# EAGLE design nsl_drone (EAGLE 5.10)

## Sheet 1 of 2
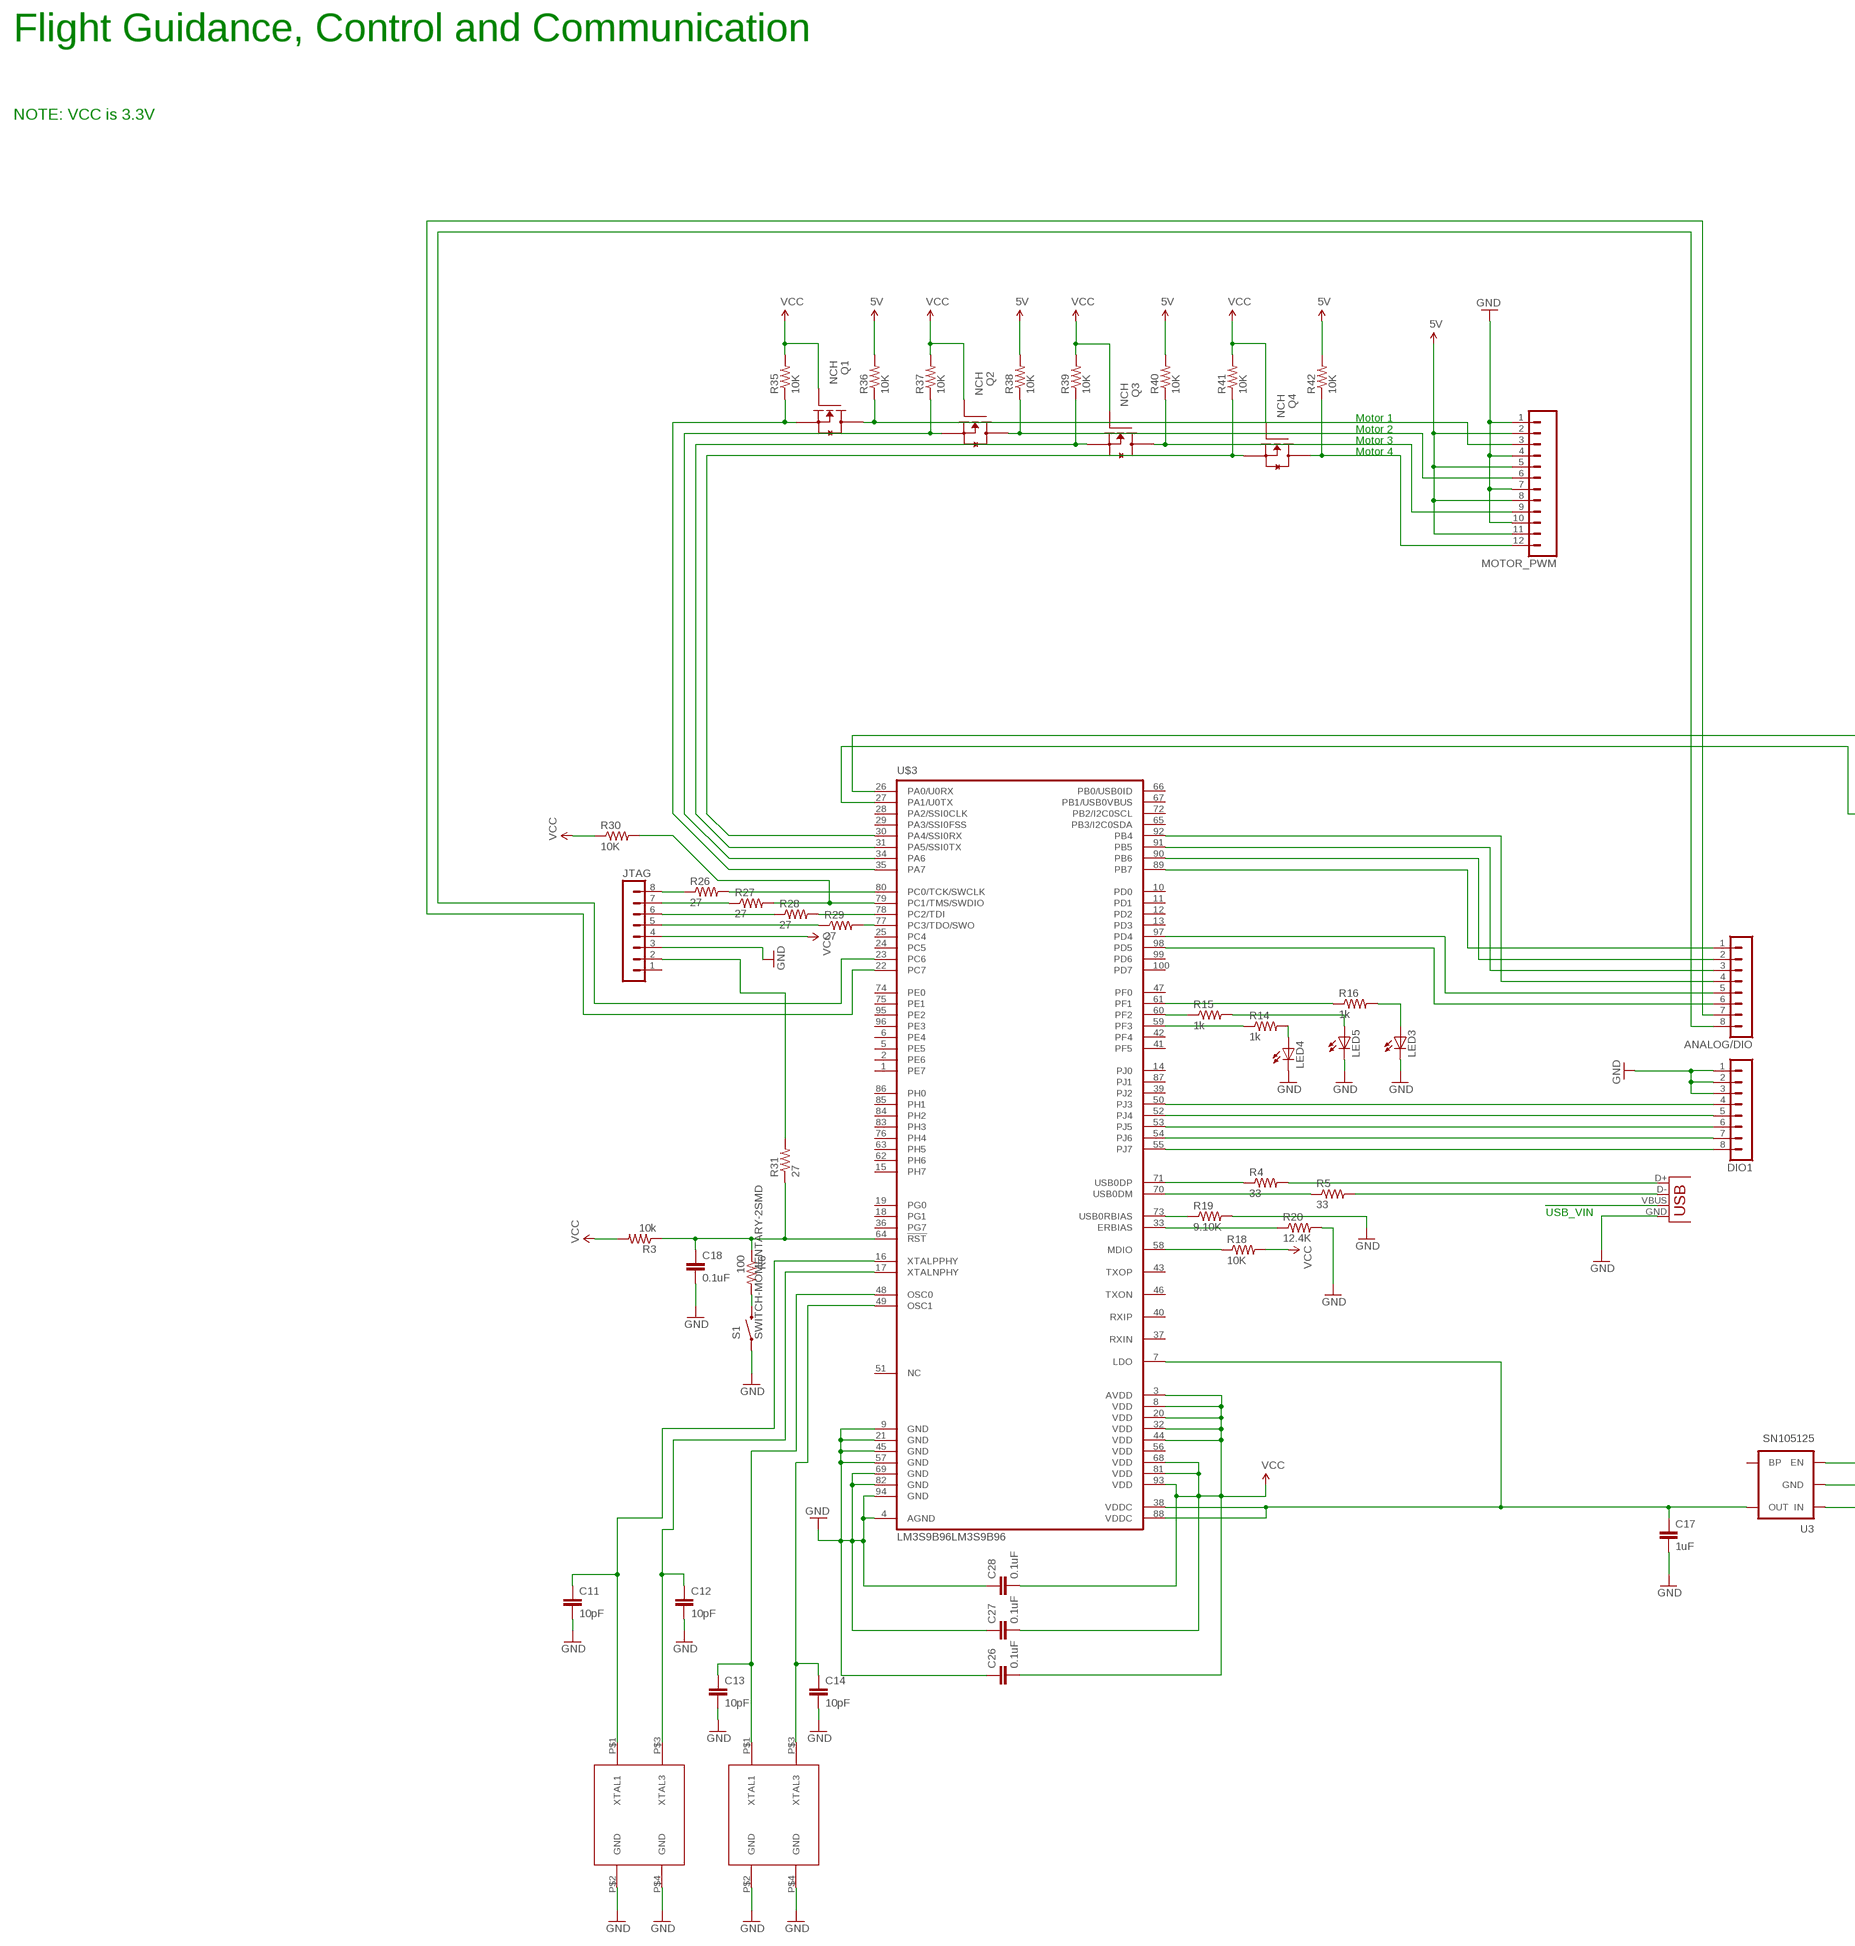
[diagram p0: schematic, sheet 1, part 1 of 2]
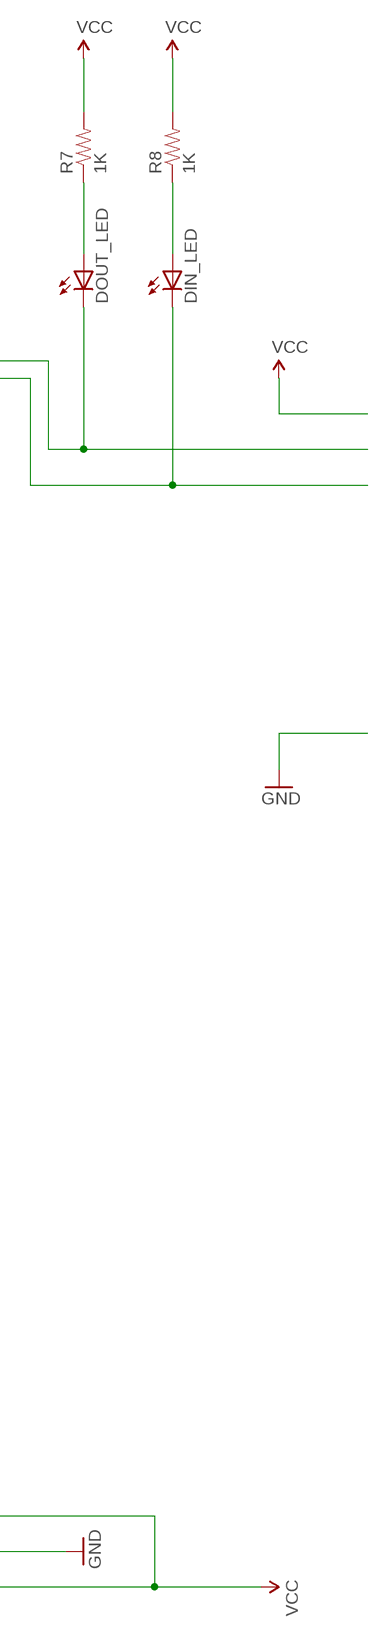
[diagram p1: schematic, sheet 1, part 2 of 2]

### Parts
16MHZ  16MHz  ABM3G  [ABM3G]
25MHZ  25MHz  ABM3G  [ABM3G]
ANALOG/DIO  MA08-1  [MA08-1]
C11  10pF  CAP0402-CAP  [0402-CAP]
C12  10pF  CAP0402-CAP  [0402-CAP]
C13  10pF  CAP0402-CAP  [0402-CAP]
C14  10pF  CAP0402-CAP  [0402-CAP]
C17  1uF  CAP0805  [0805]
C18  0.1uF  CAP0402-CAP  [0402-CAP]
C26  0.1uF  CAP0805  [0805]
C27  0.1uF  CAP0805  [0805]
C28  0.1uF  CAP0805  [0805]
DIN_LED  LED1206  [LED-1206]
DIO1  MA08-1  [MA08-1]
DOUT_LED  LED1206  [LED-1206]
JTAG  MA08-1  [MA08-1]
LED3  LED1206  [LED-1206]
LED4  LED1206  [LED-1206]
LED5  LED1206  [LED-1206]
MOTOR_PWM  M12PTH  [1X12]
Q1  NCH  MOSFET-NCH_SOT-23  [SOT95P280X135-3N]
Q2  NCH  MOSFET-NCH_SOT-23  [SOT95P280X135-3N]
Q3  NCH  MOSFET-NCH_SOT-23  [SOT95P280X135-3N]
Q4  NCH  MOSFET-NCH_SOT-23  [SOT95P280X135-3N]
R3  10k  RESISTOR  [0805]
R4  33  RESISTOR  [0805]
R5  33  RESISTOR  [0805]
R6  100  RESISTOR  [0805]
R7  1K  RESISTOR  [0805]
R8  1K  RESISTOR  [0805]
R14  1k  RESISTOR  [0805]
R15  1k  RESISTOR  [0805]
R16  1k  RESISTOR  [0805]
R18  10K  RESISTOR  [0805]
R19  9.10K  RESISTOR  [0805]
R20  12.4K  RESISTOR  [0805]
R26  27  RESISTOR  [0805]
R27  27  RESISTOR  [0805]
R28  27  RESISTOR  [0805]
R29  27  RESISTOR  [0805]
R30  10K  RESISTOR  [0805]
R31  27  RESISTOR  [0805]
R35  10K  RESISTOR0402-RES  [0402-RES]
R36  10K  RESISTOR0402-RES  [0402-RES]
R37  10K  RESISTOR0402-RES  [0402-RES]
R38  10K  RESISTOR0402-RES  [0402-RES]
R39  10K  RESISTOR0402-RES  [0402-RES]
R40  10K  RESISTOR0402-RES  [0402-RES]
R41  10K  RESISTOR0402-RES  [0402-RES]
R42  10K  RESISTOR0402-RES  [0402-RES]
S1  SWITCH-MOMENTARY-2SMD  [TACTILE_SWITCH_SMD]
U3  SN105125  V_REG_LDOSMD  [SOT23-5]
U$3  LM3S9B96LM3S9B96  [LQFP100]
X2  USBSMD  [USB-MINIB]

### Nets
5V: MOTOR_PWM.2 MOTOR_PWM.5 MOTOR_PWM.8 MOTOR_PWM.11 R36.2 R38.2 R40.2 R42.2 ; also sheet 2
GND: 16MHZ.P$2(GND) 16MHZ.P$4(GND) 25MHZ.P$2(GND) 25MHZ.P$4(GND) C11.2 C12.2 C13.2 C14.2 C17.2 C18.2 C26.1 C27.1 C28.1 DIO1.1 DIO1.2 DIO1.3 JTAG.3 LED3.C LED4.C LED5.C MOTOR_PWM.1 MOTOR_PWM.4 MOTOR_PWM.7 MOTOR_PWM.10 R19.2 R20.2 S1.1 U3.2(GND) U$3.4(AGND) U$3.9(GND) U$3.21(GND) U$3.45(GND) U$3.57(GND) U$3.69(GND) U$3.82(GND) U$3.94(GND) X2.GND ; also sheet 2
MOTOR1: MOTOR_PWM.3 Q1.3(D) R36.1
MOTOR1_LV: Q1.2(S) R35.1 U$3.35(PA7)
MOTOR2: MOTOR_PWM.6 Q2.3(D) R38.1
MOTOR2_LV: Q2.2(S) R37.1 U$3.34(PA6)
MOTOR3: MOTOR_PWM.9 Q3.3(D) R40.1
MOTOR3_LV: Q3.2(S) R39.1 U$3.31(PA5/SSI0TX)
MOTOR4: MOTOR_PWM.12 Q4.3(D) R42.1
MOTOR4_LV: Q4.2(S) R41.1 U$3.30(PA4/SSI0RX)
N$5: LED3.A R16.2
N$6: R4.1 U$3.71(USB0DP)
N$7: R4.2 X2.D+
N$8: C17.1 U3.5(OUT) U$3.7(LDO) U$3.38(VDDC) U$3.88(VDDC)
N$9: R6.2 S1.3
N$10: R5.2 X2.D-
N$12: JTAG.8 R26.1
N$13: R26.2 U$3.80(PC0/TCK/SWCLK)
N$14: R27.2 R30.2 U$3.79(PC1/TMS/SWDIO)
N$15: R5.1 U$3.70(USB0DM)
N$16: DIN_LED.C U$3.27(PA1/U0TX)
N$17: DOUT_LED.C U$3.26(PA0/U0RX)
N$20: JTAG.7 R27.1
N$23: JTAG.6 R28.1
N$24: R28.2 U$3.78(PC2/TDI)
N$25: R29.2 U$3.77(PC3/TDO/SWO)
N$26: JTAG.5 R29.1
N$27: LED5.A R15.2
N$28: LED4.A R14.2
N$29: DIN_LED.A R8.1
N$30: DOUT_LED.A R7.1
N$31: ANALOG/DIO.7 U$3.22(PC7)
N$32: R19.1 U$3.73(USB0RBIAS)
N$33: 25MHZ.P$1(XTAL1) C11.1 U$3.16(XTALPPHY)
N$34: R18.1 U$3.58(MDIO)
N$35: R20.1 U$3.33(ERBIAS)
N$40: 25MHZ.P$3(XTAL3) C12.1 U$3.17(XTALNPHY)
N$43: ANALOG/DIO.8 U$3.23(PC6)
N$44: JTAG.2 R31.2
N$47: 16MHZ.P$1(XTAL1) C13.1 U$3.48(OSC0)
N$48: 16MHZ.P$3(XTAL3) C14.1 U$3.49(OSC1)
N$49: DIO1.8 U$3.55(PJ7)
N$50: DIO1.7 U$3.54(PJ6)
N$51: DIO1.6 U$3.53(PJ5)
N$52: DIO1.5 U$3.52(PJ4)
N$53: DIO1.4 U$3.50(PJ3)
N$56: ANALOG/DIO.6 U$3.98(PD5)
N$57: ANALOG/DIO.5 U$3.97(PD4)
N$58: ANALOG/DIO.1 U$3.89(PB7)
N$59: ANALOG/DIO.2 U$3.90(PB6)
N$61: R14.1 U$3.59(PF3)
N$63: R15.1 U$3.60(PF2)
N$64: ANALOG/DIO.3 U$3.91(PB5)
N$66: R16.1 U$3.61(PF1)
N$69: ANALOG/DIO.4 U$3.92(PB4)
N$72: C18.1 R3.1 R6.1 R31.1 U$3.64(!RST!)
USB_VIN: X2.VBUS ; also sheet 2
VCC: C26.2 C27.2 C28.2 JTAG.4 Q1.1(G) Q2.1(G) Q3.1(G) Q4.1(G) R3.2 R7.2 R8.2 R18.2 R30.1 R35.2 R37.2 R39.2 R41.2 U3.1(IN) U3.3(EN) U$3.3(AVDD) U$3.8(VDD) U$3.20(VDD) U$3.32(VDD) U$3.44(VDD) U$3.68(VDD) U$3.81(VDD) U$3.93(VDD) ; also sheet 2
Unconnected: JTAG.1 U3.4(BP) U$3.1(PE7) U$3.2(PE6) U$3.5(PE5) U$3.6(PE4) U$3.10(PD0) U$3.11(PD1) U$3.12(PD2) U$3.13(PD3) U$3.14(PJ0) U$3.15(PH7) U$3.18(PG1) U$3.19(PG0) U$3.24(PC5) U$3.25(PC4) U$3.28(PA2/SSI0CLK) U$3.29(PA3/SSI0FSS) U$3.36(PG7) U$3.37(RXIN) U$3.39(PJ2) U$3.40(RXIP) U$3.41(PF5) U$3.42(PF4) U$3.43(TXOP) U$3.46(TXON) U$3.47(PF0) U$3.51(NC) U$3.62(PH6) U$3.63(PH5) U$3.65(PB3/I2C0SDA) U$3.66(PB0/USB0ID) U$3.67(PB1/USB0VBUS) U$3.72(PB2/I2C0SCL) U$3.74(PE0) U$3.75(PE1) U$3.76(PH4) U$3.83(PH3) U$3.84(PH2) U$3.85(PH1) U$3.86(PH0) U$3.87(PJ1) U$3.95(PE2) U$3.96(PE3) U$3.99(PD6) U$3.100(PD7)

### Notes on the sheet
- Flight Guidance, Control and Communication
- NOTE: VCC is 3.3V
- Motor 1
- Motor 2
- Motor 3
- Motor 4
- USB_VIN

## Sheet 2 of 2
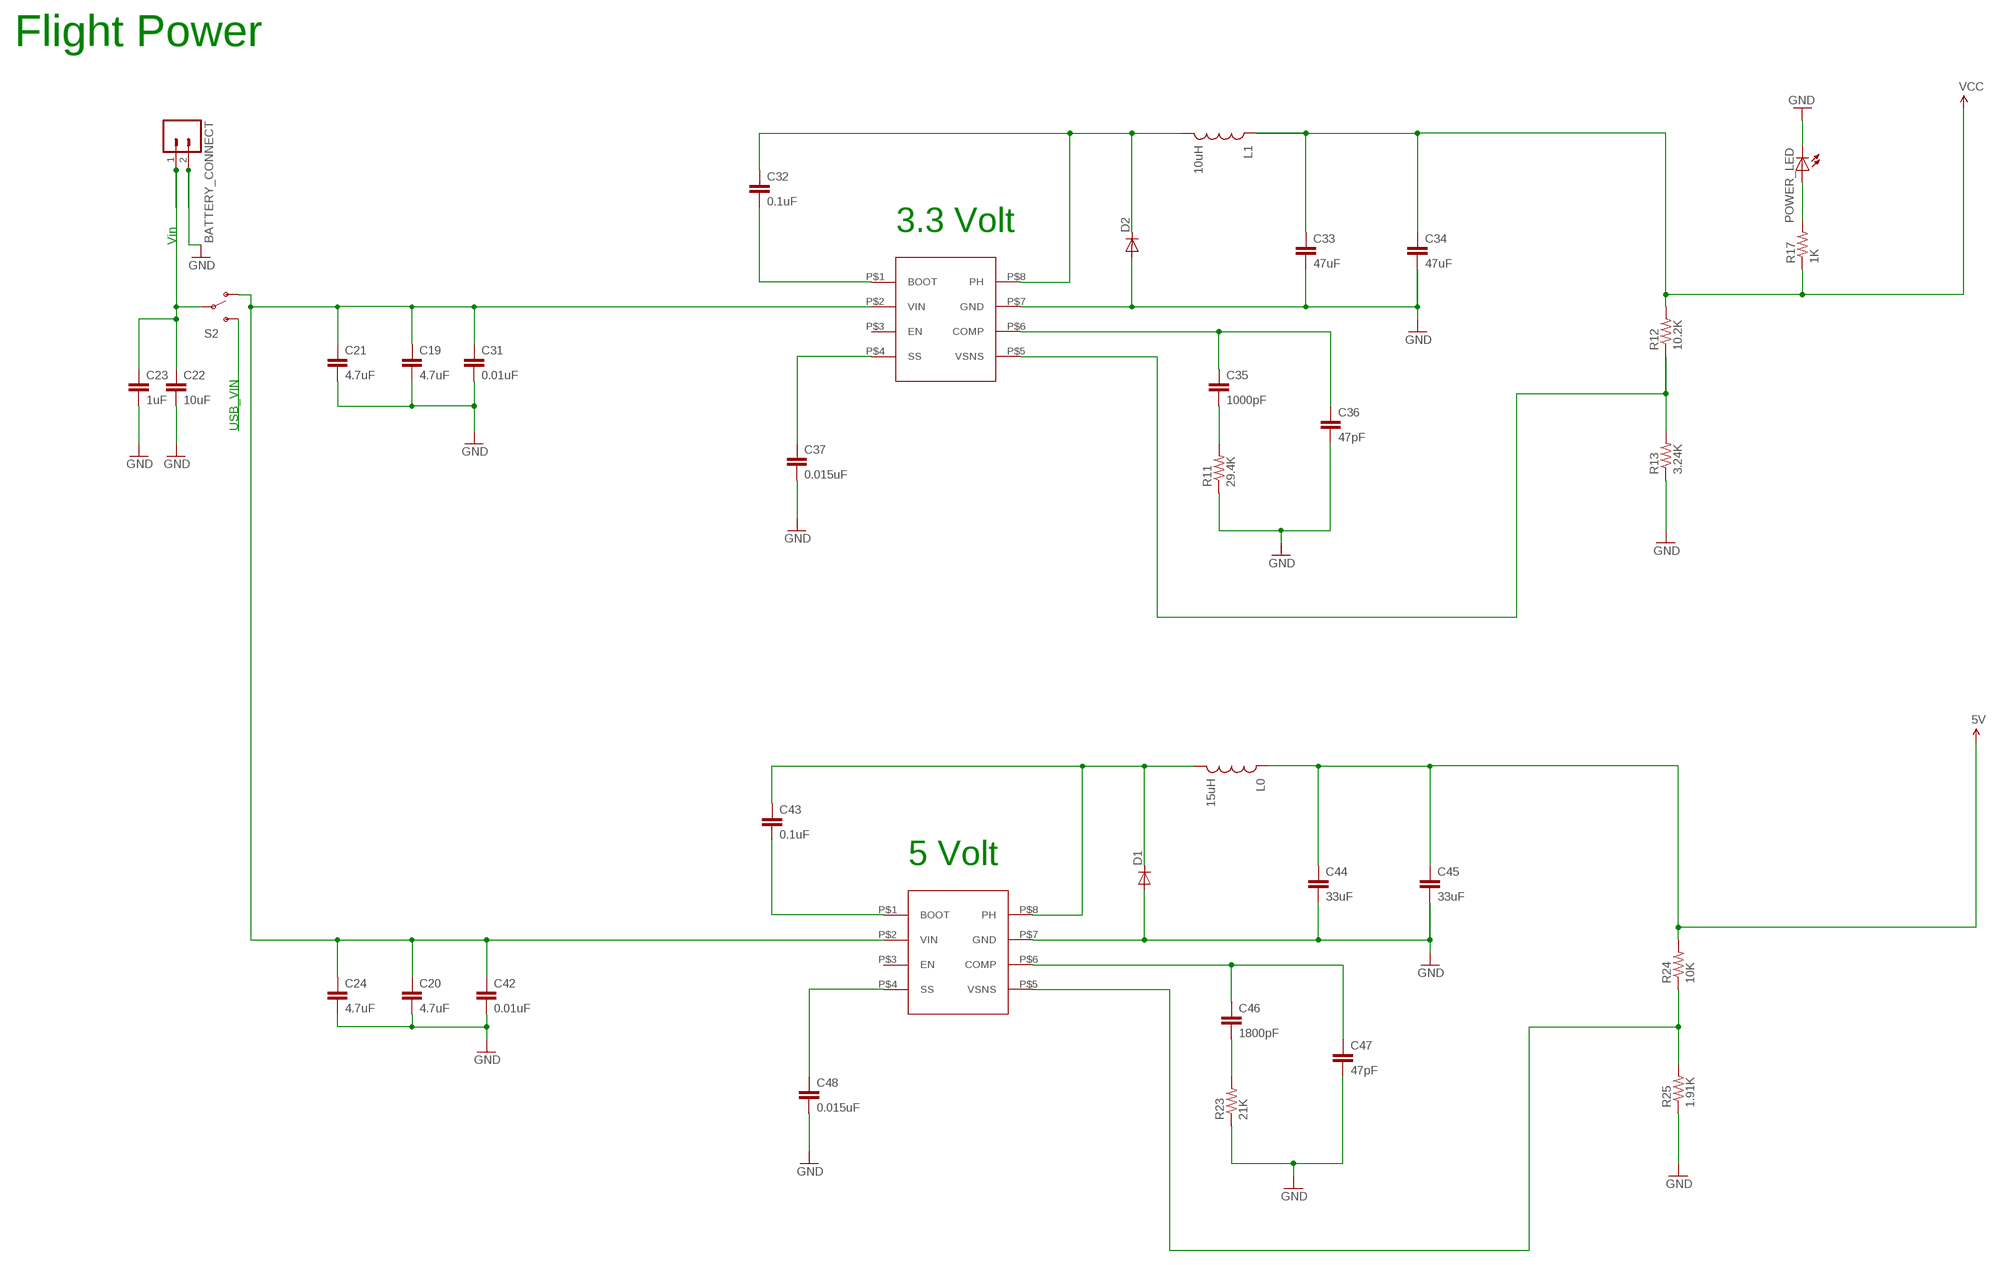
[diagram p2: schematic, sheet 2]

### Parts
BATTERY_CONNECT  M025MM  [SCREWTERMINAL-5MM-2]
C19  4.7uF  CAP0805  [0805]
C20  4.7uF  CAP0805  [0805]
C21  4.7uF  CAP0805  [0805]
C22  10uF  CAP1210  [1210]
C23  1uF  CAP1206  [1206]
C24  4.7uF  CAP0805  [0805]
C31  0.01uF  CAP0805  [0805]
C32  0.1uF  CAP0805  [0805]
C33  47uF  CAP0805  [0805]
C34  47uF  CAP0805  [0805]
C35  1000pF  CAP0805  [0805]
C36  47pF  CAP0805  [0805]
C37  0.015uF  CAP0805  [0805]
C42  0.01uF  CAP0805  [0805]
C43  0.1uF  CAP0805  [0805]
C44  33uF  CAP0805  [0805]
C45  33uF  CAP0805  [0805]
C46  1800pF  CAP0805  [0805]
C47  47pF  CAP0805  [0805]
C48  0.015uF  CAP0805  [0805]
D1  DIODESMA  [SMA-DIODE]
D2  DIODESMA  [SMA-DIODE]
L0  15uH  INDUCTOR1210  [1210]
L1  10uH  INDUCTORCR54  [CR54]
POWER_LED  LED1206  [LED-1206]
R11  29.4K  RESISTOR  [0805]
R12  10.2K  RESISTOR  [0805]
R13  3.24K  RESISTOR  [0805]
R17  1K  RESISTOR  [0805]
R23  21K  RESISTOR  [0805]
R24  10K  RESISTOR  [0805]
R25  1.91K  RESISTOR  [0805]
S2  SWITCH-SPSTPTH  [SWITCH-SPDT]
U$2  TPS54231_3V3  TPS54231  [TPS54231]
U$5  TPS54231_5V  TPS54231  [TPS54231]

### Nets
5V: C44.1 C45.1 L0.1 R24.2 ; also sheet 1
GND: BATTERY_CONNECT.2 C19.2 C20.2 C21.2 C22.2 C23.2 C24.2 C31.2 C33.2 C34.2 C36.2 C37.2 C42.2 C44.2 C45.2 C47.2 C48.2 D1.A D2.A POWER_LED.C R11.1 R13.1 R23.1 R25.1 U$2.P$7(GND) U$5.P$7(GND) ; also sheet 1
N$62: C43.2 U$5.P$1(BOOT)
N$65: C32.2 U$2.P$1(BOOT)
N$67: C32.1 D2.C L1.P$2 U$2.P$8(PH)
N$68: POWER_LED.A R17.2
N$74: C35.1 C36.1 U$2.P$6(COMP)
N$75: C37.1 U$2.P$4(SS)
N$76: C35.2 R11.2
N$77: C43.1 D1.C L0.2 U$5.P$8(PH)
N$78: R12.1 R13.2 U$2.P$5(VSNS)
N$79: C48.1 U$5.P$4(SS)
N$80: C46.1 C47.1 U$5.P$6(COMP)
N$81: C46.2 R23.2
N$82: R24.1 R25.2 U$5.P$5(VSNS)
N$85: BATTERY_CONNECT.1 C22.1 C23.1 S2.2(P)
USB_VIN: S2.3(S) ; also sheet 1
VCC: C33.1 C34.1 L1.P$1 R12.2 R17.1 ; also sheet 1
VIN: C19.1 C20.1 C21.1 C24.1 C31.1 C42.1 S2.1(O) U$2.P$2(VIN) U$5.P$2(VIN)
Unconnected: U$2.P$3(EN) U$5.P$3(EN)

### Notes on the sheet
- Flight Power
- 3.3 Volt
- Vin
- USB_VIN
- 5 Volt

## Power pins joined to a net without a drawn wire
VDD: U$3.56(VDD)

## Library data of the parts
16MHZ 25MHZ = ABM3G:ABM3G
ANALOG/DIO DIO1 JTAG = con-lstb:MA08-1: PIN HEADER
BATTERY_CONNECT = SparkFun:M02: Header 2 Standard 2-pin 0.1" header. Use with straight break away headers (SKU : PRT-00116), right angle break away headers (PRT-00553), swiss pins (PRT-00743), machine pins (PRT-00117), and female headers (PRT-00115). Molex polarized connector foot print use with SKU : PRT-08233 with associated crimp pins and housings.
C11-C14 C17-C24 C26-C28 C31-C37 C42-C48 = SparkFun:CAP: Capacitor Standard 0603 ceramic capacitor, and 0.1" leaded capacitor.
D1 D2 = SparkFun:DIODE: Diode These are standard reverse protection diodes and small signal diodes. SMA package can handle up to about 1A. SOD-323 can handle about 200mA. What the SOD-323 package when ordering, there are some mfgs out there that are 5-pin packages.
DIN_LED DOUT_LED LED3-LED5 POWER_LED = SparkFun:LED: LEDs Standard schematic elements and footprints for 5mm, 3mm, 1206, and 0603 sized LEDs. 5mm - Spark Fun Electronics SKU : COM-00529 (and others)
L0 L1 = SparkFun:INDUCTOR: Inductors Basic Inductor/Choke - 0603 and 1206. Footprints are not proven and vary greatly between part numbers.
MOTOR_PWM = SparkFun:M12: Header 12 Standard 12-pin 0.1" header. Use with straight break away headers (SKU : PRT-00116), right angle break away headers (PRT-00553), swiss pins (PRT-00743), machine pins (PRT-00117), and female headers (PRT-00115).
Q1-Q4 = ipc-7351-transistor:MOSFET-NCH_
R3-R8 R11-R20 R23-R31 R35-R42 = SparkFun:RESISTOR: Resistor Basic schematic elements and footprints for 0603, 1206, and PTH 1/10th watt (small) resistors.
S1 = SparkFun:SWITCH-MOMENTARY-2
S2 = SparkFun:SWITCH-SPST: SPST Switch Simple slide switch. Spark Fun Electronics SKU : COM-00102
U3 = SparkFun:V_REG_LDO: Voltage Regulator LDO Standard 150mA LDO voltage regulator in SOT-23 layout. Micrel part MIC5205. BP (by-pass) pin is used to lower output noise with 470pF cap.
U$2 U$5 = TPS54231:TPS54231
U$3 = luminary-arm:LM3S9B96
X2 = SparkFun:USB: USB Connectors USB-B-PTH is fully proven SKU : PRT-00139 USB-miniB is fully proven SKU : PRT-00587 USB-A-PCB is untested. USB-A-H is throughly reviewed, but untested. Spark Fun Electronics SKU : PRT-00437 USB-B-SMT is throughly reviewed, but untested. Needs silkscreen touching up. USB-A-S has not been used/tested USB-MB-H has not been used/tested

## Board
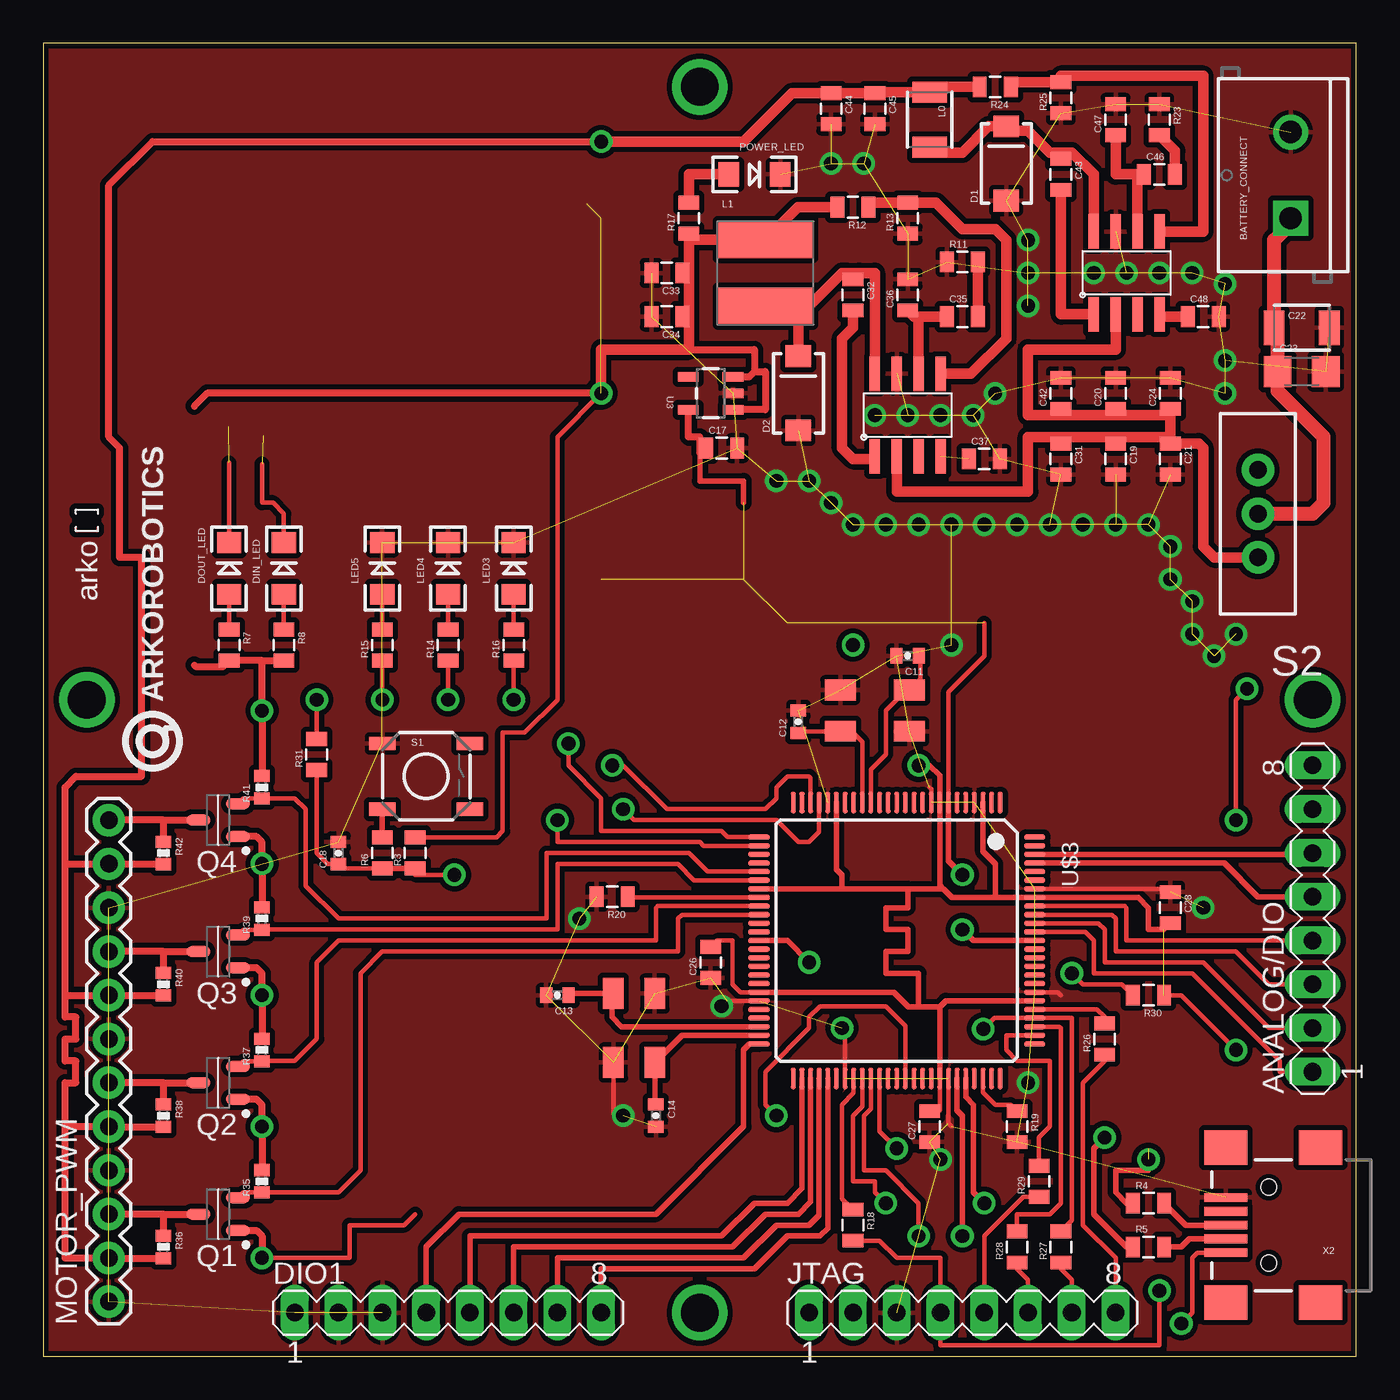
[diagram p3: board, top side]
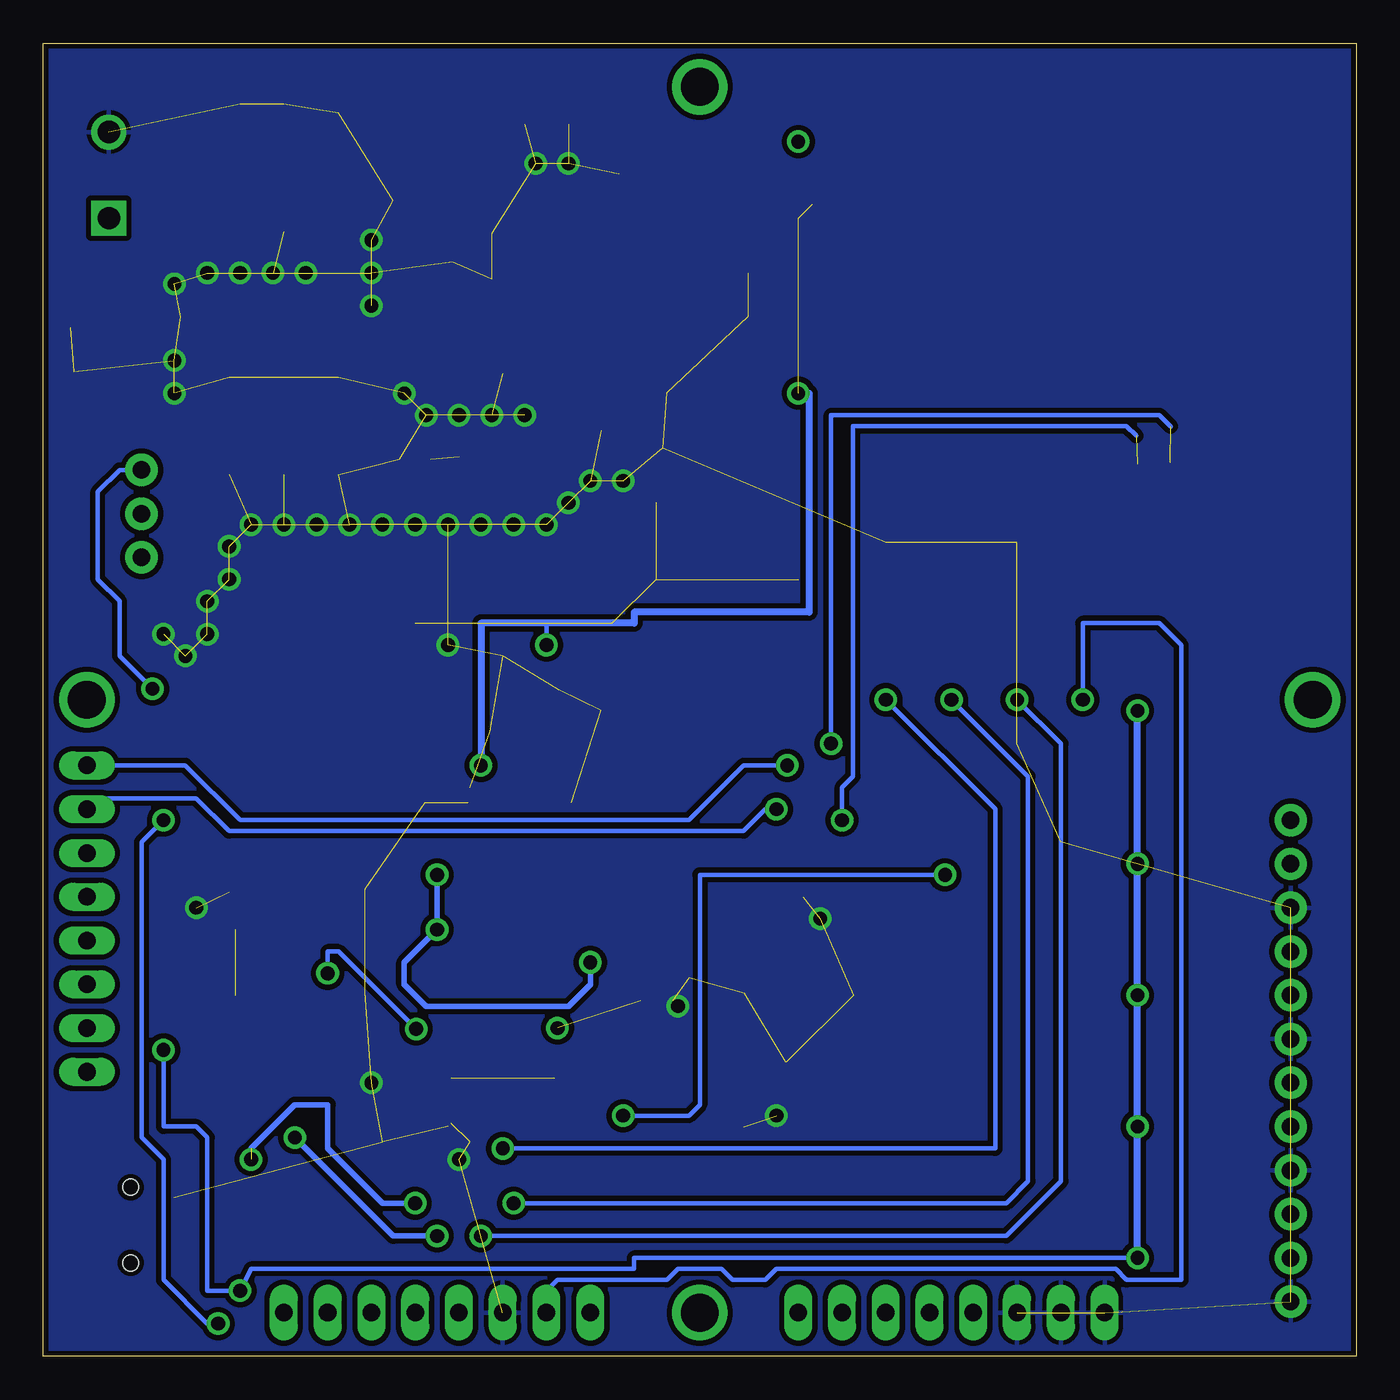
[diagram p4: board, bottom side, seen from below]

Size 76.2 x 76.2 mm. Coordinates in mm from the lower left corner, seen from the top.
Outline: 0,0 76.2,0 76.2,76.2 0,76.2 0,0
Copper layers (1*16): Top 0.0356mm / dielectric 1.5011mm / Bottom 0.0356mm
Design rules "SparkFun-mod": minimum track width 8mil, minimum drill 20mil, track to track 12mil, track to pad 12mil, pad to pad 8mil, via to via 8mil, smd to smd 8mil, copper to edge 12mil, drill to drill 8mil, minimum pad ring 12mil, minimum via ring 10mil, stop-mask expansion 4mil, vias tented up to drill 25mil, thermal gap 10mil
Milling: 4 lines

### Footprints (pad centres in the part's own frame; a part is rotated, then mirrored left to right if it is on the bottom)
ABM3G = smd 1.8 x 1.2: P$1 2,1.2; P$2 -2,1.2; P$3 -2,-1.2; P$4 2,-1.2
MA08-1 = drill 1.016 long: 1 -8.89,0; 2 -6.35,0; 3 -3.81,0; 4 -1.27,0; 5 1.27,0; 6 3.81,0; 7 6.35,0; 8 8.89,0
SCREWTERMINAL-5MM-2 = drill 1.3 pad 2.032 square: 1 0,0 | drill 1.3 pad 2.032 round: 2 5,0
0402-CAP = smd 0.7 x 0.9: 1 -0.65,0; 2 0.65,0
0805 = smd 0.8 x 1.2: 1 -0.9,0; 2 0.9,0
1210 = smd 1.2 x 2: 1 -1.6,0; 2 1.6,0
1206 = smd 1.6 x 1.8: 1 -1.4,0; 2 1.4,0
SMA-DIODE = smd 1.27 x 1.47: A -2.15,0; C 2.15,0
LED-1206 = smd 1.2 x 1.4: A -1.5,0; C 1.5,0
CR54 = smd 5.5 x 2.15: P$1 0,1.92; P$2 0,-1.92
1X12 = drill 1.016 pad 1.88 round: 1 0,0; 2 2.54,0; 3 5.08,0; 4 7.62,0; 5 10.16,0; 6 12.7,0; 7 15.24,0; 8 17.78,0; 9 20.32,0; 10 22.86,0; 11 25.4,0; 12 27.94,0
SOT95P280X135-3N = smd 1.4 x 0.65: 1 -1.15,0.95; 2 -1.15,-0.95; 3 1.15,0
0402-RES = smd 0.7 x 0.9: 1 -0.65,0; 2 0.65,0
TACTILE_SWITCH_SMD = smd 1.524 x 0.762: 1 -2.54,1.905; 2 2.54,1.905; 3 -2.54,-1.905; 4 2.54,-1.905
SWITCH-SPDT = drill 1.016 pad 1.88 round: 1 0,2.54; 2 0,0; 3 0,-2.54
SOT23-5 = smd 0.55 x 1.2: 1 -0.95,-1.3; 2 0,-1.3; 3 0.95,-1.3; 4 0.95,1.3; 5 -0.95,1.3
TPS54231 = smd 0.6 x 2: P$1 -1.905,-2.4; P$2 -0.635,-2.4; P$3 0.635,-2.4; P$4 1.905,-2.4; P$5 1.905,2.4; P$6 0.635,2.4; P$7 -0.635,2.4; P$8 -1.905,2.4
LQFP100 = smd 0.3 x 1.25: 1 -6,-8; 2 -5.5,-8; 3 -5,-8; 4 -4.5,-8; 5 -4,-8; 6 -3.5,-8; 7 -3,-8; 8 -2.5,-8; 9 -2,-8; 10 -1.5,-8; 11 -1,-8; 12 -0.5,-8; 13 0,-8; 14 0.5,-8; 15 1,-8; 16 1.5,-8; 17 2,-8; 18 2.5,-8; 19 3,-8; 20 3.5,-8; 21 4,-8; 22 4.5,-8; 23 5,-8; 24 5.5,-8; 25 6,-8; 51 6,8; 52 5.5,8; 53 5,8; 54 4.5,8; 55 4,8; 56 3.5,8; 57 3,8; 58 2.5,8; 59 2,8; 60 1.5,8; 61 1,8; 62 0.5,8; 63 0,8; 64 -0.5,8; 65 -1,8; 66 -1.5,8; 67 -2,8; 68 -2.5,8; 69 -3,8; 70 -3.5,8; 71 -4,8; 72 -4.5,8; 73 -5,8; 74 -5.5,8; 75 -6,8 | smd 1.25 x 0.3: 26 8,-6; 27 8,-5.5; 28 8,-5; 29 8,-4.5; 30 8,-4; 31 8,-3.5; 32 8,-3; 33 8,-2.5; 34 8,-2; 35 8,-1.5; 36 8,-1; 37 8,-0.5; 38 8,0; 39 8,0.5; 40 8,1; 41 8,1.5; 42 8,2; 43 8,2.5; 44 8,3; 45 8,3.5; 46 8,4; 47 8,4.5; 48 8,5; 49 8,5.5; 50 8,6; 76 -8,6; 77 -8,5.5; 78 -8,5; 79 -8,4.5; 80 -8,4; 81 -8,3.5; 82 -8,3; 83 -8,2.5; 84 -8,2; 85 -8,1.5; 86 -8,1; 87 -8,0.5; 88 -8,0; 89 -8,-0.5; 90 -8,-1; 91 -8,-1.5; 92 -8,-2; 93 -8,-2.5; 94 -8,-3; 95 -8,-3.5; 96 -8,-4; 97 -8,-4.5; 98 -8,-5; 99 -8,-5.5; 100 -8,-6
USB-MINIB = smd 2.5 x 0.5: D+ 2.5,0; D- 2.5,0.8; GND 2.5,-1.6; ID 2.5,-0.8; VBUS 2.5,1.6 | smd 2.5 x 2: GND@1 -3,-4.5; GND@2 -3,4.5; GND@3 2.5,4.5; GND@4 2.5,-4.5 | hole 0.9: 0,2.2; 0,-2.2

### Placement (x,y rotation side)
16MHZ  34.29,19.05 90 top
25MHZ  48.26,37.47 0 top
ANALOG/DIO  73.66,25.4 90 top
BATTERY_CONNECT  72.39,66.04 90 top
C11  50.16,40.64 180 top
C12  43.81,36.83 90 top
C13  29.84,20.95 180 top
C14  35.56,13.97 270 top
C17  39.37,52.7 0 top
C18  17.14,29.21 90 top
C19  62.23,52.07 270 top
C20  62.23,55.88 90 top
C21  65.41,52.07 270 top
C22  73.03,59.69 0 top
C23  73.03,57.15 0 top
C24  65.41,55.88 90 top
C26  38.73,22.86 90 top
C27  51.44,13.34 90 top
C28  65.41,26.04 270 top
C31  59.05,52.07 270 top
C32  46.99,61.59 270 top
C33  36.2,62.87 180 top
C34  36.2,60.33 180 top
C35  53.34,60.33 0 top
C36  50.16,61.59 90 top
C37  54.61,52.07 0 top
C42  59.05,55.88 90 top
C43  59.05,68.58 270 top
C44  45.72,72.39 270 top
C45  48.26,72.39 270 top
C46  64.77,68.58 0 top
C47  62.23,71.75 90 top
C48  67.31,60.33 0 top
D1  55.88,69.22 90 top
D2  43.81,55.88 90 top
DIN_LED  13.97,45.72 90 top
DIO1  23.5,2.54 0 top
DOUT_LED  10.79,45.72 90 top
JTAG  53.34,2.54 0 top
L0  51.44,71.75 270 top
L1  41.91,62.87 0 top
LED3  27.3,45.72 90 top
LED4  23.5,45.72 90 top
LED5  19.68,45.72 90 top
MOTOR_PWM  3.81,3.17 90 top
POWER_LED  41.27,68.58 0 top
Q1  10.16,8.26 180 top
Q2  10.16,15.88 180 top
Q3  10.16,23.5 180 top
Q4  10.16,31.11 180 top
R3  21.59,29.21 90 top
R4  64.14,8.89 0 top
R5  64.14,6.35 0 top
R6  19.68,29.21 90 top
R7  10.79,41.27 270 top
R8  13.97,41.27 270 top
R11  53.34,63.5 0 top
R12  46.99,66.67 180 top
R13  50.16,66.04 90 top
R14  23.5,41.27 90 top
R15  19.68,41.27 90 top
R16  27.3,41.27 90 top
R17  37.47,66.04 90 top
R18  46.99,7.62 270 top
R19  56.52,13.34 270 top
R20  33.02,26.67 180 top
R23  64.77,71.75 270 top
R24  55.24,73.66 180 top
R25  59.05,73.03 90 top
R26  61.59,18.41 90 top
R27  59.05,6.35 90 top
R28  56.52,6.35 90 top
R29  57.78,10.16 90 top
R30  64.14,20.95 180 top
R31  15.88,34.92 90 top
R35  12.7,10.16 90 top
R36  6.99,6.35 270 top
R37  12.7,17.78 90 top
R38  6.99,13.97 270 top
R39  12.7,25.4 90 top
R40  6.99,21.59 270 top
R41  12.7,33.02 90 top
R42  6.99,29.21 270 top
S1  22.23,33.66 0 top
S2  70.48,48.9 180 top
U3  38.73,55.88 90.1 top
U$1  [ARKO_LOGO]  3.17,43.81 90 top
U$2  50.16,54.61 0 top
U$3  49.53,24.13 180 top
U$5  62.87,62.87 0 top
U$7  [ARKOROBOTICS]  6.35,34.29 90 top
X2  71.12,7.62 180 top

### Tracks (layer width: path | path; a pad name or v marks a point on that pad's centre or on a via)
5V  (via drill 0.8)
  Top 0.406: v32.38,70.48 6.35,70.48 3.81,67.94 3.81,53.34 4.45,52.7 4.45,46.35 5.71,46.35 5.71,33.66 1.91,33.66 1.27,33.02 1.27,28.57 | 1.27,28.57 MOTOR_PWM.11 6.97,28.57 R42.2 | 1.27,20.95 1.27,28.57 | 1.27,20.95 MOTOR_PWM.8 3.83,20.94 R40.2 | 1.27,20.95 1.27,19.68 1.91,19.68 1.91,18.41 1.27,18.41 1.27,17.14 1.91,17.14 1.91,15.88 1.27,15.88 1.27,13.34 | 1.27,13.34 MOTOR_PWM.5 3.83,13.32 R38.2 | 1.27,13.34 1.27,5.71 MOTOR_PWM.2 3.83,5.7 R36.2
  Top 0.61: R24.2 51.74,73.66 L0.1 48.33,73.36 C45.1 C44.1 43.45,73.29 40.64,70.48 v32.38,70.48
GND  (via drill 0.8)  (102 unrouted)
  Top 0.254: 16MHZ.P$2 33.09,14.04 v33.66,13.97 | U$3.45 39.68,20.63 v39.37,20.32 | U$3.82 58.88,21.13 59.05,20.95 | U$3.9 51.53,32.92 51.44,33.02 | U$3.69 52.53,13.51 52.7,13.34 | U$3.57 46.53,18.88 46.35,19.05 | U$3.94 65.41,27.13 C28.1
  other vias: 48.26,54.61 68.58,62.23 66.67,62.87 53.98,54.61 50.16,54.61 68.58,57.78 62.87,62.87 64.77,62.87 60.96,62.87 57.15,60.96 47.62,69.22 57.15,62.87 55.24,55.88 68.58,55.88 52.07,54.61 45.72,69.22 57.15,64.77 42.55,50.8 44.45,50.8 45.72,49.53 46.99,48.26 48.9,48.26 50.8,48.26 52.7,48.26 54.61,48.26 56.52,48.26 58.42,48.26 60.33,48.26 62.23,48.26 64.14,48.26 65.41,46.99 65.41,45.09 66.67,43.81 66.67,41.91 67.94,40.64 69.22,41.91 67.31,26.04 57.15,15.88 31.11,25.4 52.07,11.43 52.7,41.27
  pour Bottom: 0,76.2 76.2,76.2 76.2,0 0,0
  pour Top: 0,76.2 76.2,76.2 76.2,0 0,0
MOTOR1
  Top 0.406: 6.99,8.26 MOTOR_PWM.3 | 6.99,8.26 Q1.3 | R36.1 6.99,8.26
MOTOR1_LV
  Top 0.254: U$3.35 37.06,25.63 36.83,25.4 36.83,23.5 19.68,23.5 18.41,22.23 18.41,10.79 17.14,9.53 12.71,9.53 R35.1 11.62,9.51 Q1.2
MOTOR2
  Top 0.406: 6.99,15.88 MOTOR_PWM.6 | 6.99,15.88 Q2.3 | R38.1 6.99,15.88
MOTOR2_LV
  Top 0.254: U$3.34 35.66,26.13 35.56,26.04 35.56,24.13 17.14,24.13 15.88,22.86 15.88,18.41 14.61,17.14 12.71,17.14 R37.1 11.62,17.13 Q2.2
MOTOR3
  Top 0.406: 6.99,23.5 MOTOR_PWM.9 | 6.99,23.5 Q3.3 | R40.1 6.99,23.5
MOTOR3_LV
  Top 0.254: U$3.31 37.77,27.63 36.83,28.57 29.84,28.57 29.84,24.77 12.71,24.77 R39.1 11.62,24.75 Q3.2
MOTOR4
  Top 0.406: 6.99,31.11 MOTOR_PWM.12 | 6.99,31.11 Q4.3 | R42.1 6.99,31.11
MOTOR4_LV
  Top 0.254: U$3.30 38.55,28.13 37.47,29.21 29.21,29.21 29.21,25.4 17.14,25.4 15.24,27.3 15.24,31.75 14.61,32.38 12.71,32.38 | R41.1 11.62,32.37 Q4.2 | R41.1 12.71,32.38 | 12.71,32.38 12.7,32.38 R41.1
N$5
  Top 0.254: R16.2 LED3.A
N$6  (via drill 0.8)  (1 unrouted)
  Top 0.305: U$3.71 53.53,15.05 53.98,14.61 53.98,9.53 v54.61,8.89 | R4.1 62.87,8.89 62.23,9.53 62.23,10.79 64.14,10.79 v64.14,11.43
  Bottom 0.305: v54.61,8.89 56.52,8.89 59.69,12.06 59.69,14.61 61.59,14.61 64.14,12.06
N$7
  Top 0.305: X2.D+ 66.31,7.62 R4.2
N$8  (via drill 0.8)  (4 unrouted)
  Top 0.254: U$3.7 52.53,38.56 54.61,40.64 54.61,42.55
  Top 0.305: U$3.7 52.53,28.75 v53.34,27.94 | U$3.88 53.98,24.13 v53.34,24.77 | U$3.38 43.18,24.13 v44.45,22.86 | 38.1,52.7 38.1,50.8 40.64,50.8 40.64,49.53
  Top 0.406: U3.5 37.44,53.37 37.47,53.34 38.1,53.34 38.1,52.7 | 38.1,52.7 38.1,52.44 C17.1 38.1,52.7
  Bottom 0.305: v53.34,27.94 v53.34,24.77 55.24,22.86 55.24,21.59 53.98,20.32 45.72,20.32 44.45,21.59 v44.45,22.86
N$9
  Top 0.305: R6.2 S1.3
N$10
  Top 0.305: X2.D- 66.51,6.82 66.04,6.35 R5.2
N$11  (via drill 0.8)
  other vias: 46.35,19.05
N$12
  Top 0.254: R26.1 61.59,17.14 60.33,15.88 60.33,7.62 62.23,5.71 JTAG.8
N$13
  Top 0.254: U$3.80 61.15,20.13 61.59,19.68 R26.2
N$14  (via drill 0.8)
  Top 0.254: R27.2 59.69,7.88 59.69,19.63 U$3.79 55.19,19.63 v54.55,19 | v59.69,22.23 60.33,21.59 62.6,21.59 R30.2
  Bottom 0.254: 54.61,19.05 v54.55,19 59.05,23.5 59.69,23.5 v59.69,22.23
N$15  (via drill 0.8)
  Top 0.305: U$3.70 53.03,14.28 53.34,13.97 v53.34,6.99 | R5.1 62.87,6.35 60.96,8.26 60.96,12.06 v61.59,12.7
  Bottom 0.305: v53.34,6.99 55.88,6.99 v61.59,12.7
N$16  (via drill 0.8)  (1 unrouted)
  Top 0.254: U$3.27 38.31,29.63 38.1,29.84 29.84,29.84 v29.84,31.11 | DIN_LED.C 13.97,48.9 13.34,49.53 12.7,49.53 12.7,51.78
  Bottom 0.254: 12.78,53.42 13.34,53.98 29.21,53.98 29.21,33.66 29.84,33.02 v29.84,31.11
N$17  (via drill 0.8)  (1 unrouted)
  Top 0.254: U$3.26 39.72,30.13 39.37,30.48 32.38,30.48 32.38,32.38 30.48,34.29 v30.48,35.56 | DOUT_LED.C 10.79,51.85
  Bottom 0.254: 10.78,53.96 11.43,54.61 30.48,54.61 v30.48,35.56
N$20
  Top 0.254: R27.1 59.05,5.08 59.69,4.45 JTAG.7
N$23
  Top 0.254: R28.1 56.52,5.08 57.15,4.45 JTAG.6
N$24
  Top 0.254: U$3.78 58.98,19.13 59.05,19.05 59.05,8.89 58.42,8.26 56.52,8.26 R28.2
N$25
  Top 0.254: U$3.77 55.88,18.63 55.88,17.78 56.52,17.14 58.42,17.14 58.42,13.34 57.78,12.7 R29.2
N$26
  Top 0.254: R29.1 56.88,9.26 54.61,6.99 JTAG.5
N$27
  Top 0.254: R15.2 LED5.A
N$28
  Top 0.254: R14.2 LED4.A
N$29
  Top 0.254: R8.1 DIN_LED.A
N$30
  Top 0.254: R7.1 DOUT_LED.A
N$31  (via drill 0.8)
  Top 0.254: U$3.22 45.03,30.43 44.45,29.84 43.81,29.84 42.55,31.11 34.29,31.11 v33.66,31.75
  Bottom 0.254: v33.66,31.75 34.29,31.75 35.56,30.48 65.41,30.48 67.31,32.38 73.03,32.38 ANALOG/DIO.7
N$32
  Top 0.254: U$3.73 54.53,15.32 55.24,14.61 56.15,14.61 R19.1
N$33
  Top 0.254: U$3.16 48.03,34.06 48.9,34.92 48.9,37.47 50.09,38.66 25MHZ.P$1 50.9,39.3 50.9,40.56 C11.1
N$34
  Top 0.254: U$3.58 47.03,15.28 46.35,14.61 46.35,9.15 R18.1
N$35
  Top 0.254: U$3.33 33.96,26.63 R20.1
N$40
  Top 0.254: U$3.17 47.53,35.66 46.99,36.2 46.33,36.2 25MHZ.P$3 43.9,36.27 C12.1
N$43  (via drill 0.8)
  Top 0.254: U$3.23 44.53,33.58 44.45,33.66 43.18,33.66 42.55,33.02 42.55,32.38 41.91,31.75 36.2,31.75 33.66,34.29 v33.02,34.29
  Bottom 0.254: v33.02,34.29 35.56,34.29 38.73,31.11 64.77,31.11 67.94,34.29 ANALOG/DIO.8
N$44  (via drill 0.8)
  Top 0.254: v15.88,38.1 R31.2
  Bottom 0.254: JTAG.2 46.99,3.81 46.35,4.45 40.01,4.45 39.37,5.08 36.83,5.08 36.2,4.45 34.29,4.45 33.66,5.08 13.97,5.08 13.34,4.45 10.16,4.45 10.16,41.27 11.43,42.55 15.88,42.55 v15.88,38.1
N$45  (via drill 2.2)
  other vias: 38.1,2.54
N$46  (via drill 2.2)
  other vias: 73.66,38.1
N$47
  Top 0.305: U$3.48 33.58,19.13 33.02,19.68 33.02,20.98 16MHZ.P$1 30.59,21.05 C13.1
N$48
  Top 0.305: U$3.49 37.07,18.63 16MHZ.P$3 35.49,14.69 C14.1
N$49
  Top 0.305: U$3.55 45.53,7.43 45.09,6.99 43.18,6.99 41.27,5.08 32.38,5.08 DIO1.8
N$50
  Top 0.305: U$3.54 45.03,8.2 44.45,7.62 42.55,7.62 40.64,5.71 29.84,5.71 DIO1.7
N$51
  Top 0.305: U$3.53 44.53,8.97 43.81,8.26 41.91,8.26 40.01,6.35 27.3,6.35 DIO1.6
N$52
  Top 0.305: U$3.52 44.03,9.74 43.18,8.89 41.27,8.89 39.37,6.99 24.77,6.99 DIO1.5
N$53
  Top 0.305: U$3.50 40.99,18.13 40.64,17.78 40.64,13.34 35.56,8.26 24.13,8.26 22.23,6.35 DIO1.4
N$54  (via drill 2.2)
  other vias: 2.54,38.1
N$55  (via drill 2.2)
  other vias: 38.1,73.66
N$56
  Top 0.305: U$3.98 73.58,29.13 ANALOG/DIO.6
N$57
  Top 0.305: U$3.97 68.53,28.63 70.48,26.67 ANALOG/DIO.5
N$58
  Top 0.254: ANALOG/DIO.1 71.75,16.51 71.75,17.14 66.67,22.23 60.96,22.23 60.96,24.13 60.46,24.63 U$3.89
N$59
  Top 0.254: U$3.90 61.23,25.13 61.59,24.77 61.59,22.86 67.31,22.86 71.12,19.05 ANALOG/DIO.2
N$61  (via drill 0.8)
  Top 0.254: U$3.59 47.53,14.51 46.99,13.97 46.99,10.16 48.26,10.16 48.26,9.53 v48.9,8.89 | v23.5,38.1 R14.1
  Bottom 0.254: v48.9,8.89 20.32,8.89 19.05,10.16 19.05,33.66 v23.5,38.1
N$62
  Top 0.61: U$5.P$1 59.05,60.47 C43.2
N$63  (via drill 0.8)
  Top 0.254: U$3.60 48.03,14.38 47.62,13.97 47.62,10.79 48.9,10.79 50.8,8.89 v50.8,6.99 | v19.68,38.1 R15.1
  Bottom 0.254: v50.8,6.99 20.32,6.99 17.14,10.16 17.14,35.56 v19.68,38.1
N$64
  Top 0.254: U$3.91 62,25.63 62.23,25.4 62.23,23.5 69.22,23.5 71.12,21.59 ANALOG/DIO.3
N$65
  Top 0.61: C32.2 46.99,59.69 46.35,59.05 46.35,52.7 46.99,52.07 48.12,52.07 U$2.P$1
N$66  (via drill 0.8)
  Top 0.254: v27.3,38.1 R16.1 | U$3.61 48.53,13.06 v49.53,12.06
  Bottom 0.254: v27.3,38.1 20.95,31.75 20.95,12.06 v49.53,12.06
N$67
  Top 0.61: U$2.P$8 48.26,62.87 47.36,62.87 | 47.36,62.87 C32.1 46.62,62.87 | L1.P$2 43.83,60.95 | 46.62,62.87 46.35,62.87 44.44,60.95 43.83,60.95 | 46.62,62.87 47.36,62.87 | 43.83,60.95 43.81,60.96 D2.C
N$68
  Top 0.61: R17.2 37.47,68.58 POWER_LED.A
N$69
  Top 0.254: U$3.92 62.77,26.13 62.87,26.04 62.87,24.13 ANALOG/DIO.4
N$72  (via drill 0.8)
  Top 0.254: v42.55,13.97 41.91,14.61 41.91,16.51 44.45,19.05 44.45,19.68 45.09,20.32 48.9,20.32 50.03,19.18 U$3.64 | v23.86,27.94 21.59,27.94 R3.1 | R6.1 17.39,28.31 C18.1 17.13,28.57 16.51,28.57 15.88,29.21 R31.1
  Top 0.305: R6.1 R3.1
  Bottom 0.254: v42.55,13.97 38.73,13.97 38.1,14.61 38.1,27.94 v23.86,27.94
N$74
  Top 0.61: 50.8,60.33 C35.1 | C36.1 50.53,60.33 50.8,60.33 | 50.8,60.33 U$2.P$6
N$75  (1 unrouted)
N$76
  Top 0.61: C35.2 R11.2
N$77
  Top 0.61: U$5.P$8 60.96,68.58 59.69,69.85 59.42,69.85 | 59.42,69.85 C43.1 59.05,69.85 | 59.05,69.85 58.42,69.85 57.15,71.12 56.12,71.12 D1.C 54.85,71.36 53.34,69.85 51.74,69.85 L0.2 | 59.05,69.85 59.42,69.85
N$78
  Top 0.61: R12.1 48.16,66.94 R13.2 51.8,66.94 53.34,65.41 55.24,65.41 55.88,64.77 55.88,59.05 53.84,57.01 U$2.P$5
N$79
  Top 0.61: C48.1 64.77,60.33 U$5.P$4
N$80
  Top 0.61: U$5.P$6 63.5,67.94 63.5,68.21 | 63.5,68.21 C46.1 63.5,68.58 | 63.5,68.58 62.23,68.58 C47.1 | 63.5,68.21 63.5,68.58
N$81
  Top 0.61: C46.2 65.67,69.95 R23.2
N$82
  Top 0.61: U$5.P$5 67.31,65.27 67.31,74.3 59.05,74.3 R25.2 56.15,73.92 R24.1
N$85
  Top 0.813: S2.2 73.66,48.9 74.3,49.53 74.3,53.34 71.62,56.01 C23.1 71.62,59.69 C22.1 71.42,64.77 72.39,65.73 BATTERY_CONNECT.1
USB_VIN  (via drill 0.8)
  Top 0.254: X2.VBUS 66.98,6.02 66.67,5.71 66.67,2.54 v66.04,1.91 | v69.85,38.73 69.22,38.1 v69.22,31.11
  Bottom 0.254: S2.3 71.75,51.44 73.03,50.16 73.03,45.09 71.75,43.81 71.75,40.64 v69.85,38.73 | v66.04,1.91 66.67,1.91 69.22,4.45 69.22,11.43 70.48,12.7 70.48,29.84 v69.22,31.11
VCC  (via drill 0.8)  (3 unrouted)
  Top 0.254: U$3.44 40.47,21.13 40.01,21.59 40.01,24.13 39.1,24.13 C26.2 | R18.2 48.52,6.72 49.53,5.71 52.07,5.71 JTAG.4 52.07,0.64 64.77,0.64 v64.77,3.81 | v32.38,55.88 29.84,53.34 29.84,38.1 27.94,36.2 26.67,36.2 26.67,30.48 26.3,30.11 R3.2 | U$3.68 52.03,14.28 C27.2 | 21.59,8.26 20.95,7.62 17.78,7.62 17.78,5.71 v12.7,5.71 | R30.1 66.04,20.95 v69.22,17.78
  Top 0.305: C28.2 65.03,24.77 64.14,24.77 64.14,26.04 63.54,26.63 U$3.93 55.24,26.63 | 55.24,26.63 52.74,26.63 52.24,27.13 | 52.24,27.13 52.03,27.34 U$3.8 52.03,33.7 51.44,34.29 v50.8,34.29 | 46.35,27.13 U$3.32 | 50.16,27.13 46.35,27.13 | 50.16,27.13 52.24,27.13 | U$3.20 46.03,28.27 46.35,27.94 46.35,27.13 | U$3.44 49.35,21.13 50.2,20.28 50.8,20.28 | U$3.81 52.38,20.63 52.03,20.28 | 52.03,20.28 U$3.68 | 50.8,20.28 52.03,20.28 | 50.16,27.13 50.16,26.04 48.9,26.04 48.9,24.77 50.16,24.77 50.16,23.5 48.9,23.5 48.9,22.23 50.8,22.23 50.8,20.28 | U$3.3 54.53,29.29 55.24,28.57 55.24,26.63
  Top 0.406: 32.65,56.15 v32.38,55.88 9.53,55.88 8.78,55.13 | 8.78,40.12 8.89,40.01 10.43,40.01 R7.2 12.7,40.38 | 12.7,40.38 R8.2 | R41.2 v12.7,37.47 12.7,40.38 | Q4.1 12.38,30.16 12.7,29.84 v12.7,28.57 R39.2 | R37.2 v12.7,20.95 12.7,22.23 12.38,22.55 Q3.1 | Q2.1 12.38,14.93 12.7,14.61 v12.7,13.34 R35.2 | Q1.1 12.38,7.3 12.7,6.99 v12.7,5.71 | 41.27,57.15 41.27,58.42 37.47,58.42 | U3.3 40.96,56.83 41.27,57.15 | 41.27,57.15 41.91,57.15 41.91,54.93 U3.1
  Top 0.61: R12.2 43.8,66.67 L1.P$1 37.82,64.78 R17.1 | R17.1 37.47,63.23 C33.1 37.47,62.87 37.47,60.7 C34.1 | R17.1 37.47,58.42 32.38,58.42 v32.38,55.88
  Bottom 0.254: v12.7,5.71 41.91,5.71 41.91,5.08 64.14,5.08 v64.77,3.81 66.67,3.81 66.67,12.7 67.31,13.34 69.22,13.34 v69.22,17.78 | 46.99,42.55 v46.99,41.27
  Bottom 0.406: v12.7,37.47 v12.7,28.57 v12.7,20.95 v12.7,13.34 v12.7,5.71 | v32.38,55.88 31.75,55.88 31.75,43.18 41.91,43.18 41.91,42.55 46.99,42.55 50.8,42.55 v50.8,34.29
VIN
  Top 0.61: U$5.P$2 62.23,58.42 57.15,58.42 57.15,54.61 59.05,54.61 | 65.41,54.61 62.23,54.61 | 65.41,54.61 C24.1 | 62.23,54.61 C20.1 | 59.05,54.61 C42.1 | S2.1 67.94,46.35 67.31,46.99 67.31,52.7 67.05,52.97 C21.1 65.41,53.34 | 62.23,54.61 59.05,54.61 | 65.41,53.34 65.41,54.61 | 59.05,53.34 57.15,53.34 57.15,50.16 49.53,50.16 U$2.P$2 | 59.05,53.34 62.23,53.34 | 62.23,53.34 65.41,53.34 | 59.05,53.34 C31.1 | 62.23,53.34 C19.1